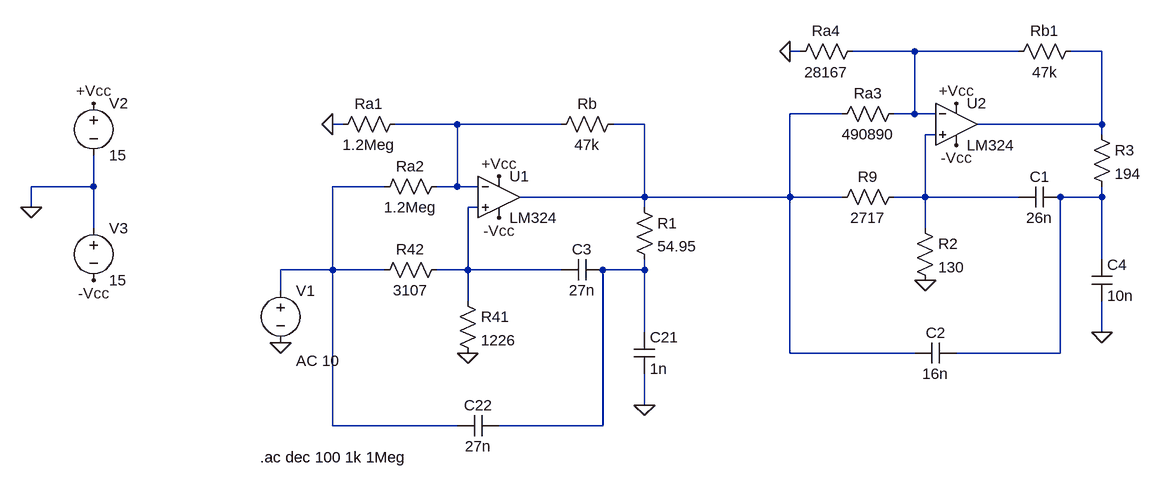
[diagram p0: schematic Sedra_complete.asc]
Sedra_complete.asc, the LTspice schematic file:
Version 4
SHEET 1 1620 680
WIRE 896 -224 880 -224
WIRE 1072 -224 976 -224
WIRE 1232 -224 1072 -224
WIRE 1360 -224 1312 -224
WIRE 960 -128 880 -128
WIRE 1072 -128 1072 -224
WIRE 1072 -128 1040 -128
WIRE 1104 -128 1072 -128
WIRE 192 -112 176 -112
WIRE 368 -112 272 -112
WIRE 528 -112 368 -112
WIRE 656 -112 608 -112
WIRE 1360 -112 1360 -224
WIRE 1360 -112 1168 -112
WIRE 1104 -96 1088 -96
WIRE 1360 -96 1360 -112
WIRE -192 -16 -192 -64
WIRE -192 -16 -288 -16
WIRE 256 -16 176 -16
WIRE 368 -16 368 -112
WIRE 368 -16 336 -16
WIRE 400 -16 368 -16
WIRE 656 0 656 -112
WIRE 656 0 464 0
WIRE 880 0 880 -128
WIRE 880 0 656 0
WIRE 960 0 880 0
WIRE 1088 0 1088 -96
WIRE 1088 0 1040 0
WIRE 1232 0 1088 0
WIRE 1360 0 1360 -16
WIRE 1360 0 1296 0
WIRE -288 16 -288 -16
WIRE 400 16 384 16
WIRE 656 16 656 0
WIRE -192 48 -192 -16
WIRE 1088 48 1088 0
WIRE 1360 96 1360 0
WIRE 176 112 176 -16
WIRE 176 112 96 112
WIRE 256 112 176 112
WIRE 384 112 384 16
WIRE 384 112 336 112
WIRE 528 112 384 112
WIRE 656 112 656 96
WIRE 656 112 592 112
WIRE 96 144 96 112
WIRE 384 160 384 112
WIRE 656 208 656 112
WIRE 1360 208 1360 160
WIRE 880 240 880 0
WIRE 1072 240 880 240
WIRE 1296 240 1296 0
WIRE 1296 240 1136 240
WIRE 656 320 656 272
WIRE 176 352 176 112
WIRE 368 352 176 352
WIRE 592 352 592 112
WIRE 592 352 432 352
FLAG 96 224 0
FLAG 384 240 0
FLAG 176 -112 0
FLAG 656 320 0
FLAG -288 16 0
FLAG 432 -32 +Vcc
FLAG 432 32 -Vcc
FLAG -192 -144 +Vcc
FLAG -192 128 -Vcc
FLAG 1088 128 0
FLAG 880 -224 0
FLAG 1360 208 0
FLAG 1136 -144 +Vcc
FLAG 1136 -80 -Vcc
SYMBOL voltage 96 128 R0
WINDOW 123 24 124 Left 2
WINDOW 39 0 0 Left 0
SYMATTR Value2 AC 10
SYMATTR InstName V1
SYMATTR Value ""
SYMBOL res 352 96 R90
WINDOW 0 0 56 VBottom 2
WINDOW 3 32 56 VTop 2
SYMATTR InstName R42
SYMATTR Value 3107
SYMBOL res 352 -32 R90
WINDOW 0 0 56 VBottom 2
WINDOW 3 32 56 VTop 2
SYMATTR InstName Ra2
SYMATTR Value 1.2Meg
SYMBOL sympropio\\LM324 432 -64 R0
SYMATTR InstName U1
SYMBOL res 368 144 R0
SYMATTR InstName R41
SYMATTR Value 1226
SYMBOL cap 592 96 R90
WINDOW 0 0 32 VBottom 2
WINDOW 3 32 32 VTop 2
SYMATTR InstName C3
SYMATTR Value 27n
SYMBOL cap 432 336 R90
WINDOW 0 0 32 VBottom 2
WINDOW 3 32 32 VTop 2
SYMATTR InstName C22
SYMATTR Value 27n
SYMBOL res 288 -128 R90
WINDOW 0 0 56 VBottom 2
WINDOW 3 32 56 VTop 2
SYMATTR InstName Ra1
SYMATTR Value 1.2Meg
SYMBOL res 624 -128 R90
WINDOW 0 0 56 VBottom 2
WINDOW 3 32 56 VTop 2
SYMATTR InstName Rb
SYMATTR Value 47k
SYMBOL cap 640 208 R0
SYMATTR InstName C21
SYMATTR Value 1n
SYMBOL voltage -192 -160 R0
WINDOW 123 0 0 Left 0
WINDOW 39 0 0 Left 0
SYMATTR InstName V2
SYMATTR Value 15
SYMBOL voltage -192 32 R0
WINDOW 123 0 0 Left 0
WINDOW 39 0 0 Left 0
SYMATTR InstName V3
SYMATTR Value 15
SYMBOL res 1056 -16 R90
WINDOW 0 0 56 VBottom 2
WINDOW 3 32 56 VTop 2
SYMATTR InstName R9
SYMATTR Value 2717
SYMBOL res 1056 -144 R90
WINDOW 0 0 56 VBottom 2
WINDOW 3 32 56 VTop 2
SYMATTR InstName Ra3
SYMATTR Value 490890
SYMBOL sympropio\\LM324 1136 -176 R0
SYMATTR InstName U2
SYMBOL res 1072 32 R0
SYMATTR InstName R2
SYMATTR Value 130
SYMBOL cap 1296 -16 R90
WINDOW 0 0 32 VBottom 2
WINDOW 3 32 32 VTop 2
SYMATTR InstName C1
SYMATTR Value 26n
SYMBOL cap 1136 224 R90
WINDOW 0 0 32 VBottom 2
WINDOW 3 32 32 VTop 2
SYMATTR InstName C2
SYMATTR Value 16n
SYMBOL res 992 -240 R90
WINDOW 0 0 56 VBottom 2
WINDOW 3 32 56 VTop 2
SYMATTR InstName Ra4
SYMATTR Value 28167
SYMBOL res 1328 -240 R90
WINDOW 0 0 56 VBottom 2
WINDOW 3 32 56 VTop 2
SYMATTR InstName Rb1
SYMATTR Value 47k
SYMBOL cap 1344 96 R0
SYMATTR InstName C4
SYMATTR Value 10n
SYMBOL res 640 0 R0
SYMATTR InstName R1
SYMATTR Value 54.95
SYMBOL res 1344 -112 R0
SYMATTR InstName R3
SYMATTR Value 194
TEXT 64 400 Left 2 !.ac dec 100 1k 1Meg

The netlist it stands for:
* Sedra_complete.asc
V1 N006 0 AC 10
R42 N008 N006 3107
Ra2 N004 N006 1.2Meg
* U1: LM324 (symbol sympropio\LM324 not available, pins judged from their places): In+=N008 In-=N004 V+=+Vcc V-=-Vcc OUT=N003
R41 N008 0 1226
C3 N009 N008 27n
C22 N009 N006 27n
Ra1 N004 0 1.2Meg
Rb N003 N004 47k
C21 N009 0 1n
V2 +Vcc 0 15
V3 0 -Vcc 15
R9 N005 N003 2717
Ra3 N001 N003 490890
* U2: LM324 (symbol sympropio\LM324 not available, pins judged from their places): In+=N005 In-=N001 V+=+Vcc V-=-Vcc OUT=N002
R2 N005 0 130
C1 N007 N005 26n
C2 N007 N003 16n
Ra4 N001 0 28167
Rb1 N002 N001 47k
C4 N007 0 10n
R1 N003 N009 54.95
R3 N002 N007 194
.ac dec 100 1k 1Meg
.backanno
.end